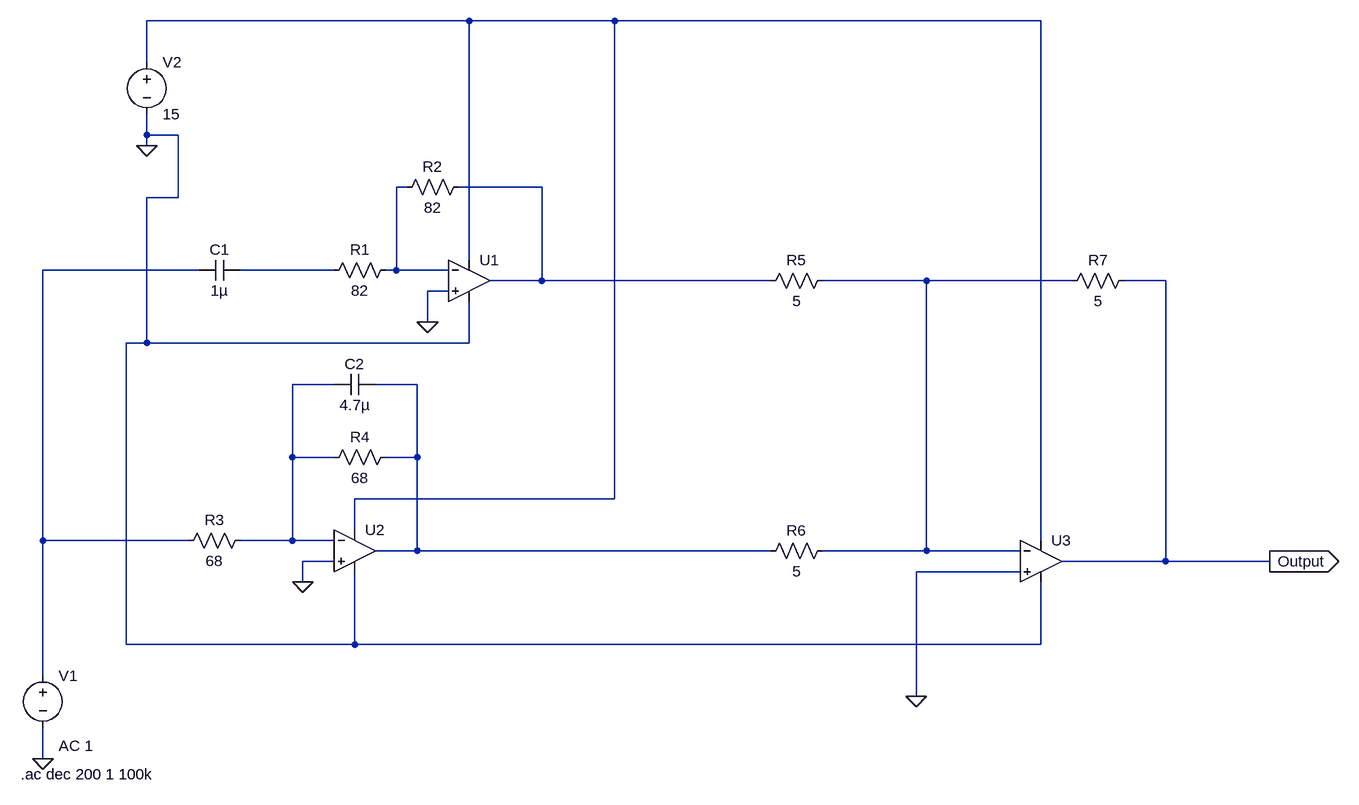
[diagram p0: schematic Livrable N°3 Coupe Bande.asc]
Livrable N°3 Coupe Bande.asc, the LTspice schematic file:
Version 4
SHEET 1 2348 1080
WIRE 576 -432 80 -432
WIRE 800 -432 576 -432
WIRE 1456 -432 800 -432
WIRE 80 -368 80 -432
WIRE 80 -256 80 -288
WIRE 128 -256 80 -256
WIRE 80 -240 80 -256
WIRE 480 -176 464 -176
WIRE 688 -176 560 -176
WIRE 128 -160 128 -256
WIRE 128 -160 80 -160
WIRE 576 -64 576 -432
WIRE 160 -48 -80 -48
WIRE 368 -48 224 -48
WIRE 464 -48 464 -176
WIRE 464 -48 448 -48
WIRE 544 -48 464 -48
WIRE 688 -32 688 -176
WIRE 688 -32 608 -32
WIRE 1040 -32 688 -32
WIRE 1280 -32 1120 -32
WIRE 1504 -32 1280 -32
WIRE 1648 -32 1584 -32
WIRE 544 -16 512 -16
WIRE 512 32 512 -16
WIRE 80 64 80 -160
WIRE 80 64 48 64
WIRE 576 64 576 0
WIRE 576 64 80 64
WIRE 368 128 304 128
WIRE 496 128 432 128
WIRE 304 240 304 128
WIRE 368 240 304 240
WIRE 496 240 496 128
WIRE 496 240 448 240
WIRE 800 304 800 -432
WIRE 800 304 400 304
WIRE 400 352 400 304
WIRE -80 368 -80 -48
WIRE 144 368 -80 368
WIRE 304 368 304 240
WIRE 304 368 224 368
WIRE 368 368 304 368
WIRE 1456 368 1456 -432
WIRE 496 384 496 240
WIRE 496 384 432 384
WIRE 1040 384 496 384
WIRE 1280 384 1280 -32
WIRE 1280 384 1120 384
WIRE 1424 384 1280 384
WIRE 368 400 320 400
WIRE 1648 400 1648 -32
WIRE 1648 400 1488 400
WIRE 1808 400 1648 400
WIRE 1424 416 1264 416
WIRE 320 432 320 400
WIRE 48 528 48 64
WIRE 400 528 400 416
WIRE 400 528 48 528
WIRE 1456 528 1456 432
WIRE 1456 528 400 528
WIRE -80 576 -80 368
WIRE 1264 608 1264 416
WIRE -80 704 -80 656
FLAG 320 432 0
FLAG 512 32 0
FLAG 80 -240 0
FLAG -80 704 0
FLAG 1264 608 0
FLAG 1808 400 Output
IOPIN 1808 400 Out
SYMBOL voltage -80 560 R0
WINDOW 123 24 124 Left 2
WINDOW 39 0 0 Left 0
SYMATTR InstName V1
SYMATTR Value ""
SYMATTR Value2 AC 1
SYMBOL cap 224 -64 R90
WINDOW 0 0 32 VBottom 2
WINDOW 3 32 32 VTop 2
SYMATTR InstName C1
SYMATTR Value 1µ
SYMBOL res 464 -64 R90
WINDOW 0 0 56 VBottom 2
WINDOW 3 32 56 VTop 2
SYMATTR InstName R1
SYMATTR Value 82
SYMBOL OpAmps\\UniversalOpAmp 576 -32 R0
SYMATTR InstName U1
SYMBOL res 576 -192 R90
WINDOW 0 0 56 VBottom 2
WINDOW 3 32 56 VTop 2
SYMATTR InstName R2
SYMATTR Value 82
SYMBOL OpAmps\\UniversalOpAmp 400 384 R0
SYMATTR InstName U2
SYMBOL res 464 224 R90
WINDOW 0 0 56 VBottom 2
WINDOW 3 32 56 VTop 2
SYMATTR InstName R4
SYMATTR Value 68
SYMBOL cap 432 112 R90
WINDOW 0 0 32 VBottom 2
WINDOW 3 32 32 VTop 2
SYMATTR InstName C2
SYMATTR Value 4.7µ
SYMBOL voltage 80 -384 R0
WINDOW 123 0 0 Left 0
WINDOW 39 0 0 Left 0
SYMATTR InstName V2
SYMATTR Value 15
SYMBOL res 240 352 R90
WINDOW 0 0 56 VBottom 2
WINDOW 3 32 56 VTop 2
SYMATTR InstName R3
SYMATTR Value 68
SYMBOL res 1136 -48 R90
WINDOW 0 0 56 VBottom 2
WINDOW 3 32 56 VTop 2
SYMATTR InstName R5
SYMATTR Value 5
SYMBOL res 1136 368 R90
WINDOW 0 0 56 VBottom 2
WINDOW 3 32 56 VTop 2
SYMATTR InstName R6
SYMATTR Value 5
SYMBOL res 1600 -48 R90
WINDOW 0 0 56 VBottom 2
WINDOW 3 32 56 VTop 2
SYMATTR InstName R7
SYMATTR Value 5
SYMBOL OpAmps\\UniversalOpAmp 1456 400 R0
SYMATTR InstName U3
TEXT -114 728 Left 2 !.ac dec 200 1 100k

The netlist it stands for:
* Livrable N°3 Coupe Bande.asc
V1 N004 0 AC 1
C1 N005 N004 1µ
R1 N002 N005 82
XU1 0 N002 N001 0 N003 level1 Avol=1Meg GBW=10Meg Vos=0 En=0 Enk=0 In=0 Ink=0 Rin=500Meg  ; pins In+ In- V+ V- OUT
R2 N003 N002 82
XU2 0 N007 N001 0 N008 level1 Avol=1Meg GBW=10Meg Vos=0 En=0 Enk=0 In=0 Ink=0 Rin=500Meg  ; pins In+ In- V+ V- OUT
R4 N008 N007 68
C2 N008 N007 4.7µ
V2 N001 0 15
R3 N007 N004 68
R5 N006 N003 5
R6 N006 N008 5
R7 Output N006 5
XU3 0 N006 N001 0 Output level1 Avol=1Meg GBW=10Meg Vos=0 En=0 Enk=0 In=0 Ink=0 Rin=500Meg  ; pins In+ In- V+ V- OUT
.ac dec 200 1 100k
.lib UniversalOpAmp1.lib
.backanno
.end